# Altium project ControlBoard_2_0.PrjPCB
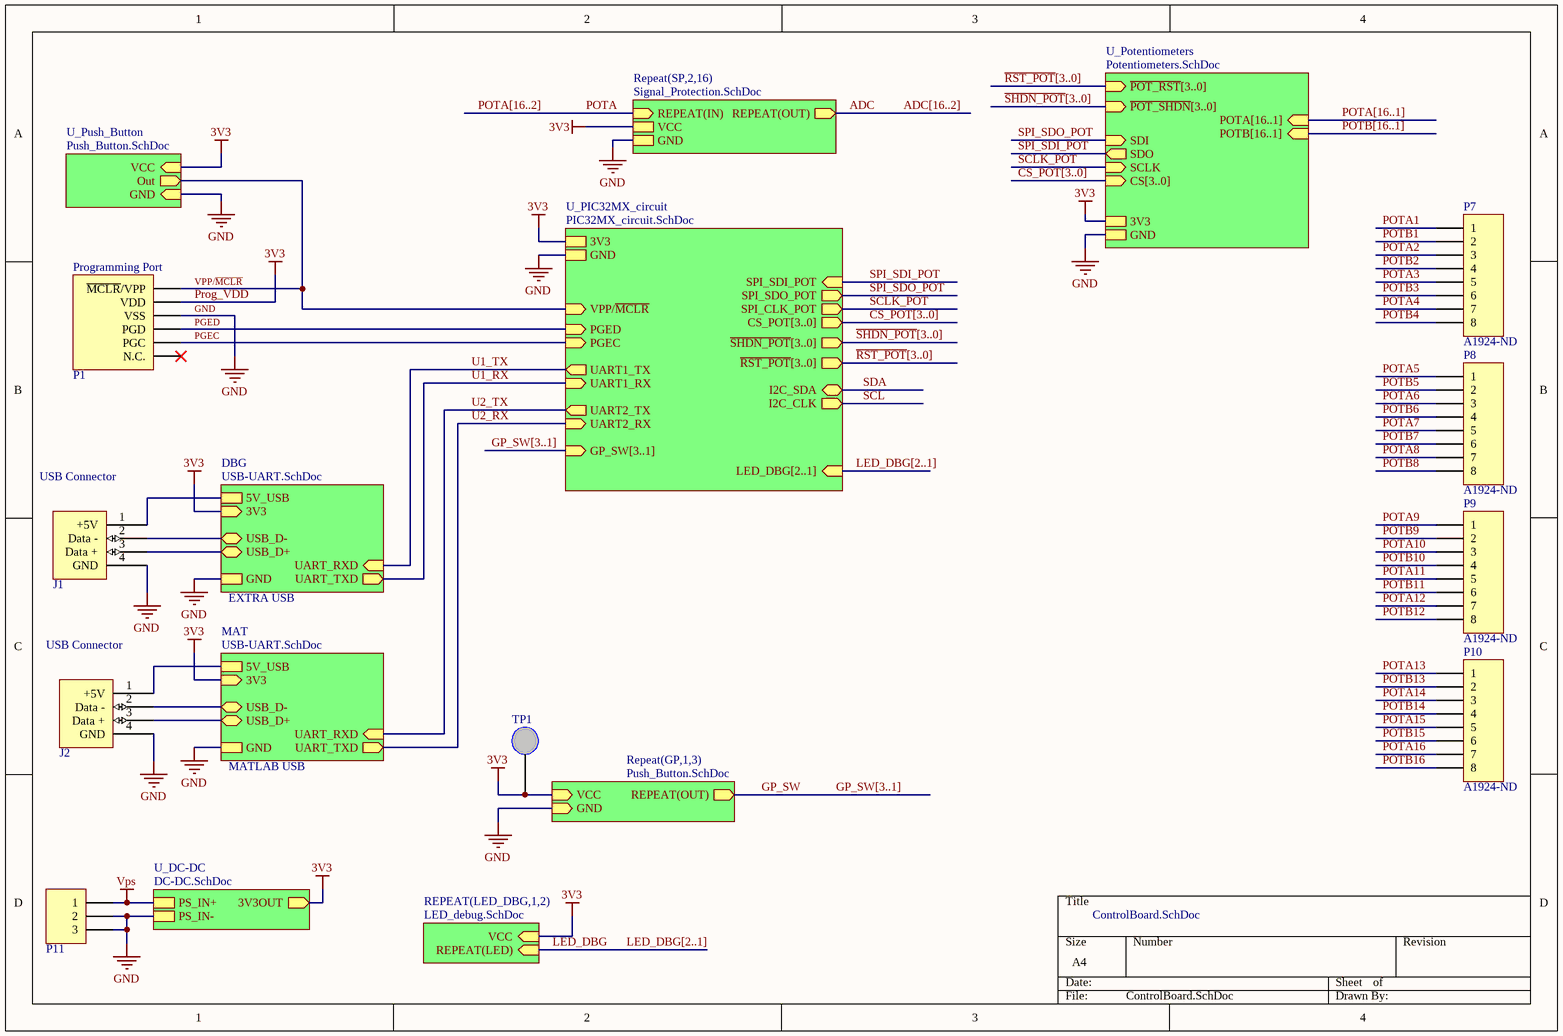
[diagram p0: ControlBoard.SchDoc]
10 sheets, 133 parts. Net scope: hierarchical (ports join the sheet entries above them; power ports are global).
Board file: ControlBoard.PcbDoc
Sheets:
  ControlBoard.SchDoc
    U_PIC32MX_circuit = PIC32MX_circuit.SchDoc
    U_DC-DC = DC-DC.SchDoc
    MAT = USB-UART.SchDoc
    DBG = USB-UART.SchDoc
  Potentiometer.SchDoc
  Signal_Acquisition.SchDoc
    ADC1 = ADS7952-Q1.SchDoc
    ADC2 = ADS7952-Q1.SchDoc
    U_Vref = Vref.SchDoc
    U_Power_Enable = Power_Enable.SchDoc
    U_PGA = PGA.SchDoc
    U_PGA = PGA.SchDoc
    U_PGA = PGA.SchDoc
    U_PGA = PGA.SchDoc

## Sheet ControlBoard.SchDoc
size A4

### Parts
J1  USB 4 pins  [CON-USB TYPE B]  (value not drawn)
J2  USB 4 pins  [CON-USB TYPE B]  (value not drawn)
P1  CON - HEADER PROG  [CON-HEADER-1X6-RA]  (value not drawn)
P7  Supplier Part Number 1: A1924-ND  [CON-HEADER-1X8]  (hidden comment: CON - HEADER 1X8)
P8  Supplier Part Number 1: A1924-ND  [CON-HEADER-1X8]  (hidden comment: CON - HEADER 1X8)
P9  Supplier Part Number 1: A1924-ND  [CON-HEADER-1X8]  (hidden comment: CON - HEADER 1X8)
P10  Supplier Part Number 1: A1924-ND  [CON-HEADER-1X8]  (hidden comment: CON - HEADER 1X8)
P11  CON - POWER CONNECTOR  [CON-POWER CONNECTOR]  (value not drawn)
TP1  5003K  [TP - VERTICAL]  (value not drawn)

### Sub-sheets
DBG = USB-UART.SchDoc: 3V3 (in), GND, UART_RXD (in), UART_TXD (out), 5V_USB, USB_D- (bidir), USB_D+ (bidir)
MAT = USB-UART.SchDoc: 3V3 (in), GND, UART_RXD (in), UART_TXD (out), 5V_USB, USB_D- (bidir), USB_D+ (bidir)
Repeat(GP,1,3) = Push_Button.SchDoc (file not in this document): REPEAT(OUT) (out), GND (in), VCC (in)
REPEAT(LED_DBG,1,2) = LED_debug.SchDoc (file not in this document): VCC (in), REPEAT(LED) (in)
Repeat(SP,2,16) = Signal_Protection.SchDoc (file not in this document): REPEAT(IN) (in), REPEAT(OUT) (out), VCC, GND
U_DC-DC = DC-DC.SchDoc: 3V3OUT (out), PS_IN+, PS_IN-
U_PIC32MX_circuit = PIC32MX_circuit.SchDoc: 3V3, GND, UART2_TX (out), UART2_RX (in), GP_SW[3..1] (in), PGED (in), PGEC (in), VPP/~{MCLR} (in), UART1_TX (out), UART1_RX (in), I2C_SDA (bidir), I2C_CLK (out), ~{RST_POT}[3..0] (out), ~{SHDN_POT}[3..0] (out), LED_DBG[2..1] (in), SPI_CLK_POT (out), SPI_SDI_POT (in), CS_POT[3..0] (out), SPI_SDO_POT (out)
U_Potentiometers = Potentiometers.SchDoc (file not in this document): SDI (in), SCLK (in), 3V3, GND, POTB[16..1] (in), CS[3..0] (in), ~{POT_RST}[3..0] (in), ~{POT_SHDN}[3..0] (in), SDO (out), POTA[16..1] (in)
U_Push_Button = Push_Button.SchDoc (file not in this document): Out (out), VCC (in), GND (in)

### Nets
5V_USB: J1.1(+5V) J2.1(+5V) ; sheet MAT/5V_USB, sheet DBG/5V_USB
GND: J1.4(GND) J1.5(Shield) J1.6(Shield) J2.4(GND) J2.5(Shield) J2.6(Shield) P1.3(VSS) P11.2 P11.3 ; sheet U_Potentiometers/GND, sheet U_PIC32MX_circuit/GND, sheet U_DC-DC/PS_IN-, sheet Repeat(GP,1,3)/GND, sheet MAT/GND, sheet DBG/GND, sheet Repeat(SP,2,16)/GND, sheet U_Push_Button/GND
Prog_VDD: P1.2(VDD) TP1.1 ; sheet U_Potentiometers/3V3, sheet U_PIC32MX_circuit/3V3, sheet U_DC-DC/3V3OUT, sheet Repeat(GP,1,3)/VCC, sheet MAT/3V3, sheet DBG/3V3, sheet Repeat(SP,2,16)/VCC, sheet U_Push_Button/VCC, sheet REPEAT(LED_DBG,1,2)/VCC  [also labelled 3V3]
Vps: P11.1 ; sheet U_DC-DC/PS_IN+
ADC: sheet Repeat(SP,2,16)/REPEAT(OUT)
GP_SW: sheet Repeat(GP,1,3)/REPEAT(OUT)
LED_DBG: sheet REPEAT(LED_DBG,1,2)/REPEAT(LED)
PGEC: P1.5(PGC) ; sheet U_PIC32MX_circuit/PGEC
PGED: P1.4(PGD) ; sheet U_PIC32MX_circuit/PGED
POTA: sheet Repeat(SP,2,16)/REPEAT(IN)
POTA1: P7.1
POTA2: P7.3
POTA3: P7.5
POTA4: P7.7
POTA5: P8.1
POTA6: P8.3
POTA7: P8.5
POTA8: P8.7
POTA9: P9.1
POTA10: P9.3
POTA11: P9.5
POTA12: P9.7
POTA13: P10.1
POTA14: P10.3
POTA15: P10.5
POTA16: P10.7
POTB1: P7.2
POTB2: P7.4
POTB3: P7.6
POTB4: P7.8
POTB5: P8.2
POTB6: P8.4
POTB7: P8.6
POTB8: P8.8
POTB9: P9.2
POTB10: P9.4
POTB11: P9.6
POTB12: P9.8
POTB13: P10.2
POTB14: P10.4
POTB15: P10.6
POTB16: P10.8
SCLK_POT: sheet U_Potentiometers/SCLK, sheet U_PIC32MX_circuit/SPI_CLK_POT
SPI_SDI_POT: sheet U_Potentiometers/SDO, sheet U_PIC32MX_circuit/SPI_SDI_POT
SPI_SDO_POT: sheet U_Potentiometers/SDI, sheet U_PIC32MX_circuit/SPI_SDO_POT
U1_RX: sheet U_PIC32MX_circuit/UART1_RX, sheet DBG/UART_TXD
U1_TX: sheet U_PIC32MX_circuit/UART1_TX, sheet DBG/UART_RXD
U2_RX: sheet U_PIC32MX_circuit/UART2_RX, sheet MAT/UART_TXD
U2_TX: sheet U_PIC32MX_circuit/UART2_TX, sheet MAT/UART_RXD
USB_D+: J2.3(Data_+) ; sheet MAT/USB_D+
USB_D+: J1.3(Data_+) ; sheet DBG/USB_D+  [a separate net that carries the same name]
USB_D-: J2.2(Data_-) ; sheet MAT/USB_D-
USB_D-: J1.2(Data_-) ; sheet DBG/USB_D-  [a separate net that carries the same name]
VPP/~{MCLR}: P1.1(~{MCLR}/VPP) ; sheet U_PIC32MX_circuit/VPP/~{MCLR}, sheet U_Push_Button/Out

Not connected (* = marked no-connect by the designer): P1 6(N.C.)*

### Buses and harness runs
bus ADC[16..2]
bus CS_POT[3..0] = sheet U_PIC32MX_circuit/CS_POT[3..0]
bus CS_POT[3..0] = sheet U_Potentiometers/CS[3..0]
bus GP_SW[3..1]
bus GP_SW[3..1] = sheet U_PIC32MX_circuit/GP_SW[3..1]
bus LED_DBG[2..1]
bus LED_DBG[2..1] = sheet U_PIC32MX_circuit/LED_DBG[2..1]
bus POTA[16..1] = sheet U_Potentiometers/POTA[16..1]
bus POTA[16..2]
bus POTB[16..1] = sheet U_Potentiometers/POTB[16..1]
bus ~{RST_POT}[3..0] = sheet U_PIC32MX_circuit/~{RST_POT}[3..0]
bus ~{RST_POT}[3..0] = sheet U_Potentiometers/~{POT_RST}[3..0]
bus ~{SHDN_POT}[3..0] = sheet U_PIC32MX_circuit/~{SHDN_POT}[3..0]
bus ~{SHDN_POT}[3..0] = sheet U_Potentiometers/~{POT_SHDN}[3..0]

### Notes on the sheet
- (near P1) Programming Port
- (near J1) USB Connector
- (near J2) USB Connector
- EXTRA USB
- MATLAB USB

### Library data of the parts
J1 J2 = CON - USB TYPE B 4 pins: 4 pin USB connector with 2 shield pins; Manufacturer: FCI; Supplier 1: Digi-Key; Supplier Part Number 1: 609-3656-ND; (FLIED A): *; (FLIED B): *; (FLIED C): *
P1 = CON - PROG HEADER 6: MICROCHIP CONNECTOR; (FLIED A): *; (FLIED B): *; (FLIED C): *; Manufacturer: *; Supplier 1: Digi-Key; Supplier Part Number 1: 609-3263-ND
P7-P10 = CON - HEADER 1X8: 100mil header 1 row 6 pins; Manufacturer: *; (FIELD A): *; (FIELD B): *; (FIELD C): *; Supplier 1: Digi-Key
P11 = CON - POWER CONNECTOR: CONN PWR JACK 2.1X5.5MM HIGH CUR; Manufacturer: *; (FIELD A): *; (FIELD B): *; (FIELD C): *; Supplier 1: Digi-Key; Supplier Part Number 1: CP-002AH-ND
TP1 = TP - Test point vertical: (FIELD A): *; (FIELD B): *; (FIELD C): *; Manufacturer: *; Supplier 1: Newark; Supplier Part Number 1: 62W5140

## Sheet PIC32MX_circuit.SchDoc
size A4
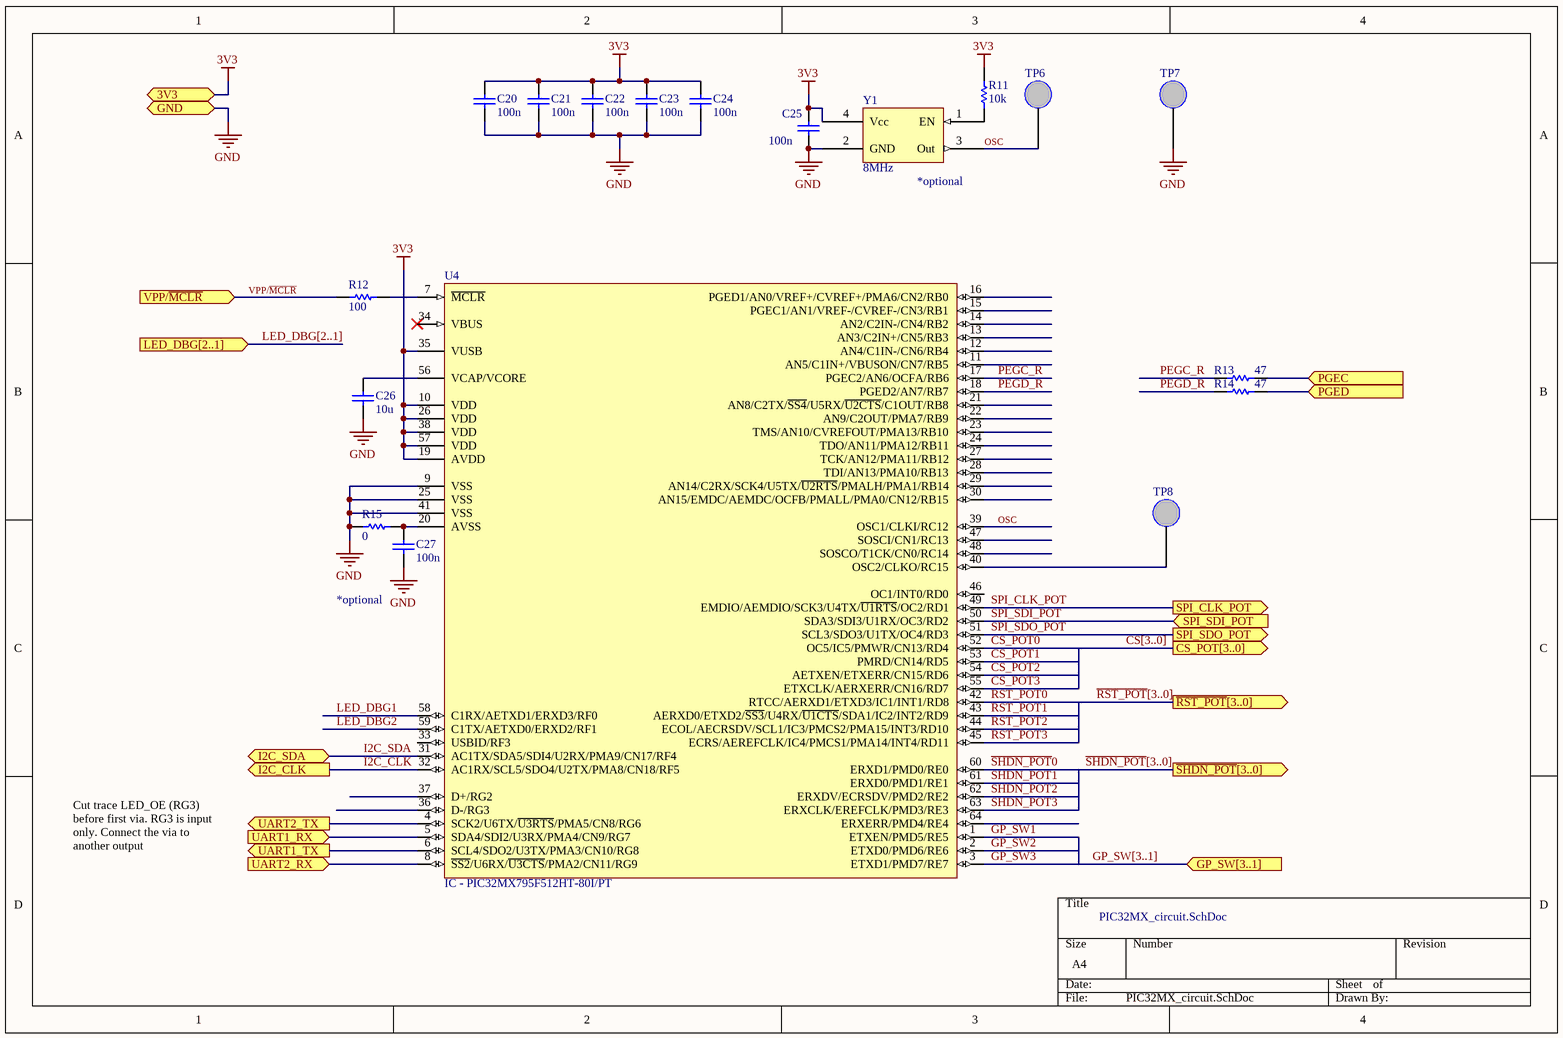
[diagram p1: PIC32MX_circuit.SchDoc]

### Parts
C20  value 100n  [CS-0603]  (hidden comment: CS - CAPACITOR)
C21  value 100n  [CS-0603]  (hidden comment: CS - CAPACITOR)
C22  value 100n  [CS-0603]  (hidden comment: CS - CAPACITOR)
C23  value 100n  [CS-0603]  (hidden comment: CS - CAPACITOR)
C24  value 100n  [CS-0603]  (hidden comment: CS - CAPACITOR)
C25  value 100n  [CS-0603]  (hidden comment: CS - CAPACITOR)
C26  value 10u  [CS-0603]  (hidden comment: CS - CAPACITOR)
C27  value 100n  [CS-0603]  (hidden comment: CS - CAPACITOR)
R11  value 10k  [RS-0603]  (hidden comment: RS - RESISTOR)
R12  value 100  [RS-0603]  (hidden comment: RS - RESISTOR)
R13  value 47  [RS-0603]  (hidden comment: RS - RESISTOR)
R14  value 47  [RS-0603]  (hidden comment: RS - RESISTOR)
R15  value 0  [RS-0603]  (hidden comment: RS - RESISTOR)
TP6  5003K  [TP - VERTICAL]  (value not drawn)
TP7  5003K  [TP - VERTICAL]  (value not drawn)
TP8  5003K  [TP - VERTICAL]  (value not drawn)
U4  IC - PIC32MX795F512HT-80I/PT  [IC-TQFP-64]
Y1  8MHz  [OSC-CB3LV]

### Ports
3V3, CS_POT[3..0] (out), GND, GP_SW[3..1] (in), I2C_CLK (out), I2C_SDA (bidir), LED_DBG[2..1] (in), PGEC (in), PGED (in), SPI_CLK_POT (out), SPI_SDI_POT (in), SPI_SDO_POT (out), UART1_RX (in), UART1_TX (out), UART2_RX (in), UART2_TX (out), VPP/~{MCLR} (in), ~{RST_POT}[3..0] (out), ~{SHDN_POT}[3..0] (out)

### Nets
3V3: C20.2 C21.2 C22.2 C23.2 C24.2 C25.2 R11.1 U4.10(VDD) U4.19(AVDD) U4.26(VDD) U4.35(VUSB) U4.38(VDD) U4.57(VDD) Y1.4(Vcc) ; port 3V3  [project net Prog_VDD]
GND: C20.1 C21.1 C22.1 C23.1 C24.1 C25.1 C26.1 C27.1 R15.2 TP7.1 U4.9(VSS) U4.25(VSS) U4.41(VSS) Y1.2(GND) ; port GND
CS_POT0: U4.52(OC5/IC5/PMWR/CN13/RD4)
CS_POT1: U4.53(PMRD/CN14/RD5)
CS_POT2: U4.54(AETXEN/ETXERR/CN15/RD6)
CS_POT3: U4.55(ETXCLK/AERXERR/CN16/RD7)
GP_SW1: U4.1(ETXEN/PMD5/RE5)
GP_SW2: U4.2(ETXD0/PMD6/RE6)
GP_SW3: U4.3(ETXD1/PMD7/RE7)
I2C_CLK: U4.32(AC1RX/SCL5/SDO4/U2TX/PMA8/CN18/RF5) ; port I2C_CLK
I2C_SDA: U4.31(AC1TX/SDA5/SDI4/U2RX/PMA9/CN17/RF4) ; port I2C_SDA
LED_DBG1: U4.58(C1RX/AETXD1/ERXD3/RF0)
LED_DBG2: U4.59(C1TX/AETXD0/ERXD2/RF1)
OSC: TP6.1 U4.39(OSC1/CLKI/RC12) Y1.3(Out)
PEGC_R: R13.1 U4.17(PGEC2/AN6/OCFA/RB6)
PEGD_R: R14.1 U4.18(PGED2/AN7/RB7)
PGEC: R13.2 ; port PGEC
PGED: R14.2 ; port PGED
~{RST_POT}0: U4.42(RTCC/AERXD1/ETXD3/IC1/INT1/RD8)
~{RST_POT}1: U4.43(AERXD0/ETXD2/~{SS3}/U4RX/~{U1CTS}/SDA1/IC2/INT2/RD9)
~{RST_POT}2: U4.44(ECOL/AECRSDV/SCL1/IC3/PMCS2/PMA15/INT3/RD10)
~{RST_POT}3: U4.45(ECRS/AEREFCLK/IC4/PMCS1/PMA14/INT4/RD11)
~{SHDN_POT}0: U4.60(ERXD1/PMD0/RE0)
~{SHDN_POT}1: U4.61(ERXD0/PMD1/RE1)
~{SHDN_POT}2: U4.62(ERXDV/ECRSDV/PMD2/RE2)
~{SHDN_POT}3: U4.63(ERXCLK/EREFCLK/PMD3/RE3)
SPI_CLK_POT: U4.49(EMDIO/AEMDIO/SCK3/U4TX/~{U1RTS}/OC2/RD1) ; port SPI_CLK_POT  [project net SCLK_POT]
SPI_SDI_POT: U4.50(SDA3/SDI3/U1RX/OC3/RD2) ; port SPI_SDI_POT
SPI_SDO_POT: U4.51(SCL3/SDO3/U1TX/OC4/RD3) ; port SPI_SDO_POT
U1_RX: U4.5(SDA4/SDI2/U3RX/PMA4/CN9/RG7) ; port UART1_RX
U1_TX: U4.6(SCL4/SDO2/U3TX/PMA3/CN10/RG8) ; port UART1_TX
U2_RX: U4.8(~{SS2}/U6RX/~{U3CTS}/PMA2/CN11/RG9) ; port UART2_RX
U2_TX: U4.4(SCK2/U6TX/~{U3RTS}/PMA5/CN8/RG6) ; port UART2_TX
VPP/~{MCLR}: R12.2 ; port VPP/~{MCLR}
NetC26_2: C26.2 U4.56(VCAP/VCORE)
NetC27_2: C27.2 R15.1 U4.20(AVSS)
NetR11_2: R11.2 Y1.1(EN)
NetR12_1: R12.1 U4.7(~{MCLR})
NetTP8_1: TP8.1 U4.40(OSC2/CLKO/RC15)

Not connected (* = marked no-connect by the designer): U4 11(AN5/C1IN+/VBUSON/CN7/RB5) 12(AN4/C1IN-/CN6/RB4) 13(AN3/C2IN+/CN5/RB3) 14(AN2/C2IN-/CN4/RB2) 15(PGEC1/AN1/VREF-/CVREF-/CN3/RB1) 16(PGED1/AN0/VREF+/CVREF+/PMA6/CN2/RB0) 21(AN8/C2TX/~{SS4}/U5RX/~{U2CTS}/C1OUT/RB8) 22(AN9/C2OUT/PMA7/RB9) 23(TMS/AN10/CVREFOUT/PMA13/RB10) 24(TDO/AN11/PMA12/RB11) 27(TCK/AN12/PMA11/RB12) 28(TDI/AN13/PMA10/RB13) 29(AN14/C2RX/SCK4/U5TX/~{U2RTS}/PMALH/PMA1/RB14) 30(AN15/EMDC/AEMDC/OCFB/PMALL/PMA0/CN12/RB15) 33(USBID/RF3) 34(VBUS)* 36(D-/RG3) 37(D+/RG2) 46(OC1/INT0/RD0) 47(SOSCI/CN1/RC13) 48(SOSCO/T1CK/CN0/RC14) 64(ERXERR/PMD4/RE4)

### Buses and harness runs
bus CS[3..0] = port CS_POT[3..0]
bus GP_SW[3..1] = port GP_SW[3..1]
bus LED_DBG[2..1] = port LED_DBG[2..1]
bus ~{RST_POT}[3..0] = port ~{RST_POT}[3..0]
bus ~{SHDN_POT}[3..0] = port ~{SHDN_POT}[3..0]

### Notes on the sheet
- (near Y1) *optional
- *optional
- Cut trace LED_OE (RG3) before first via. RG3 is input only. Connect the via to another output

### Library data of the parts
C20-C27 = CS - CAPACITOR: TOLERANCE: 10%; VOLTAGE: 16V; Supplier 1: *; Supplier Part Number 1: *; (FIELD A): *; (FLIED C): *; (FIELD B): *; Manufacturer: *
R11-R15 = RS - RESISTOR: TOLERANCE: RES TOL; POWER: RES POWER; Supplier Part Number 1: *; Supplier 1: *; (FIELD A): *; (FLIED C): *; (FIELD B): *; Manufacturer: *
TP6-TP8 = TP - Test point vertical: (FIELD A): *; (FIELD B): *; (FIELD C): *; Manufacturer: *; Supplier 1: Newark; Supplier Part Number 1: 62W5140
U4 = IC - PIC32MX795F512HT-80I/PT: Manufacturer: Microchip; Supplier 1: Digi-Key; Supplier Part Number 1: PIC32MX795F512H-80I/PT-ND; (FLIED A): *; (FLIED B): *; (FLIED C): *
Y1 = OSC - CB3LV: Oscillator; Supplier 1: Digi-Key; Supplier Part Number 1: CTX264LVCT-ND; (FLIED A): *; (FLIED B): *; (FLIED C): *; Manufacturer: *; Frequency: *

## Sheet DC-DC.SchDoc
size A4
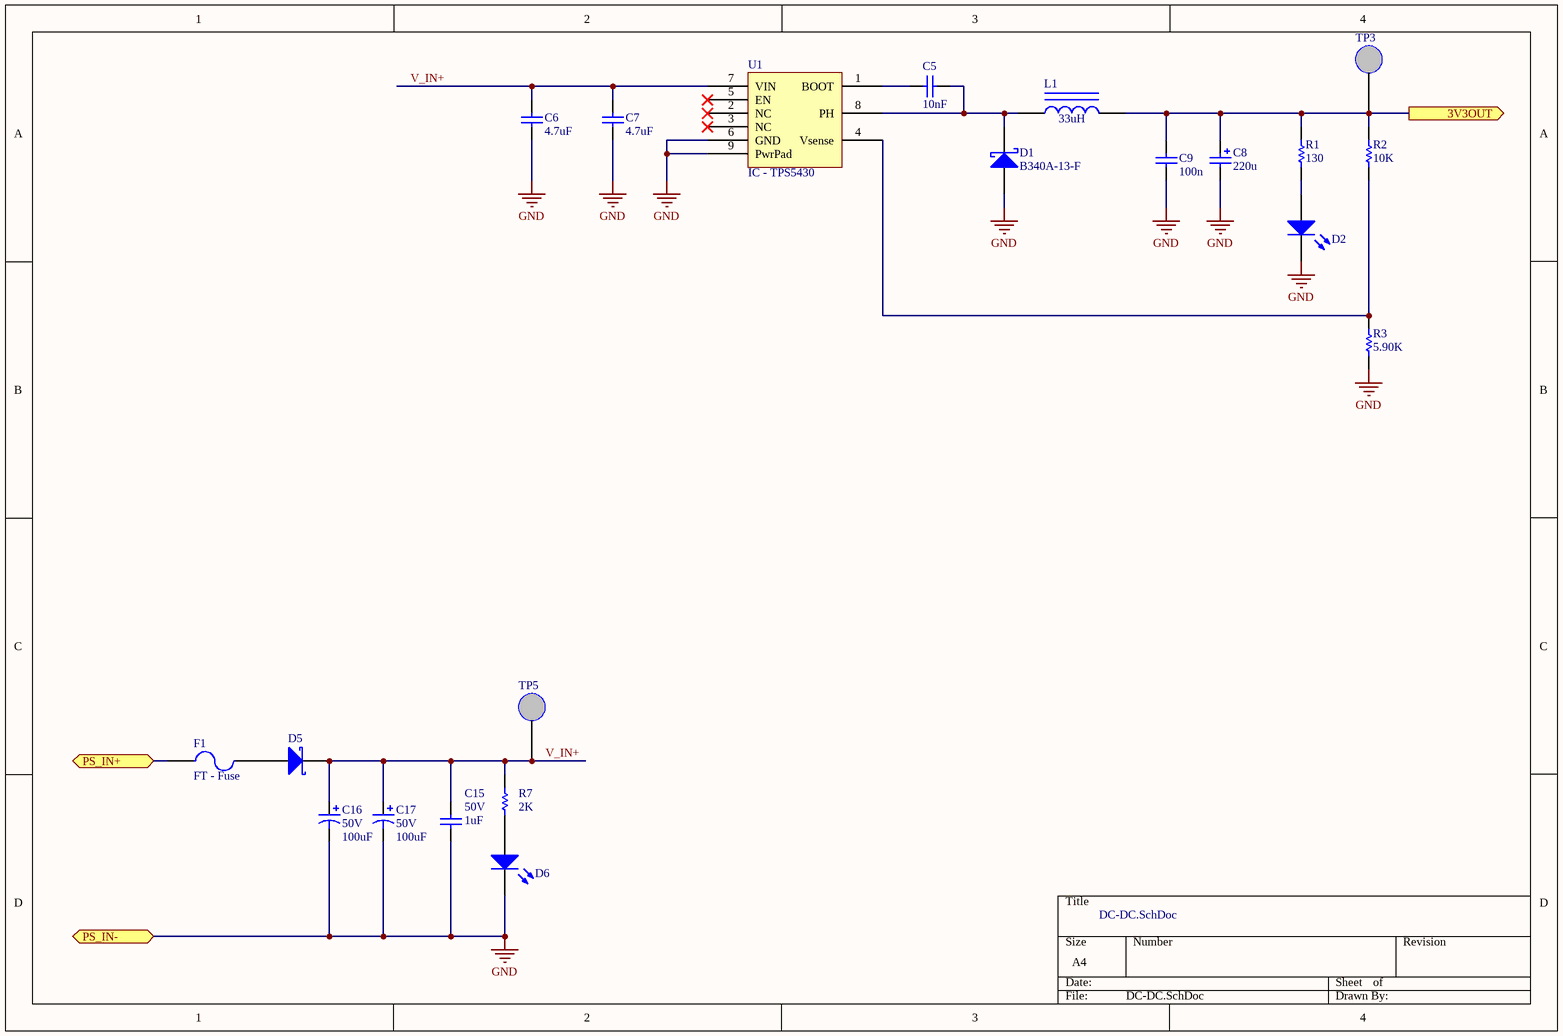
[diagram p2: DC-DC.SchDoc]

### Parts
C5  value 10nF  [CS-0603]  (hidden comment: CS - CAPACITOR)
C6  value 4.7uF  [CS-1206]  (hidden comment: CS - CAPACITOR)
C7  value 4.7uF  [CS-1206]  (hidden comment: CS - CAPACITOR)
C8  value 220u  [CS-2312]  (hidden comment: CS - CAPACITOR POL)
C9  value 100n  [CS-0603]  (hidden comment: CS - CAPACITOR)
C15  value 1uF  VOLTAGE: 50V  [CS-0603]  (hidden comment: CS - CAPACITOR)
C16  value 100uF  VOLTAGE: 50V  [CT-CAP-ALUM-8X14]  (hidden comment: CT - CAPACITOR ELECTROLYTIC)
C17  value 100uF  VOLTAGE: 50V  [CT-CAP-ALUM-8X14]  (hidden comment: CT - CAPACITOR ELECTROLYTIC)
D1  B340A-13-F  [DS-DO-214AC-SMA]
D2  LED - NORMAL LED  [LED-0603 YELLOW]  (value not drawn)
D5  DT - Diode  [TO-220AC]  (value not drawn)
D6  LED - NORMAL LED  [LED-0603 YELLOW]  (value not drawn)
F1  FT - Fuse  [FT - 5mm x 20mm]
L1  value 33uH  [LS-Inductor SMD]  (hidden comment: LS - INDUCTOR)
R1  value 130  [RS-0603]  (hidden comment: RS - RESISTOR)
R2  value 10K  [RS-0603]  (hidden comment: RS - RESISTOR)
R3  value 5.90K  [RS-0603]  (hidden comment: RS - RESISTOR)
R7  value 2K  [RS-0603]  (hidden comment: RS - RESISTOR)
TP3  5003K  [TP - VERTICAL]  (value not drawn)
TP5  5003K  [TP - VERTICAL]  (value not drawn)
U1  IC - TPS5430  [IC-SOIC8-POWERPAD]

### Ports
3V3OUT (out), PS_IN+, PS_IN-

### Nets
GND: C6.1 C7.1 C8.2 C9.1 C15.1 C16.2 C17.2 D1.A D2.K D6.K R3.2 U1.6(GND) U1.9(PwrPad) ; port PS_IN-
Prog_VDD: C8.1 C9.2 L1.2 R1.1 R2.1 TP3.1 ; port 3V3OUT
Vps: F1.1 ; port PS_IN+
V_IN+: C6.2 C7.2 C15.2 C16.1 C17.1 D5.1(K) R7.2 TP5.1 U1.7(VIN)
NetC5_1: C5.1 D1.K L1.1 U1.8(PH)
NetC5_2: C5.2 U1.1(BOOT)
NetD2_A: D2.A R1.2
NetD5_3: D5.3(A) F1.2
NetD6_A: D6.A R7.1
NetR2_2: R2.2 R3.1 U1.4(Vsense)

Not connected (* = marked no-connect by the designer): U1 2(NC)* 3(NC)* 5(EN)*

### Library data of the parts
C5 = CS - CAPACITOR: CAP CER 10000PF 50V 10% X7R 0603; Manufacturer: TDK; (FIELD A): tantalum; VOLTAGE: 16V; Supplier 1: Digikey; Supplier Part Number 1: 445-1311-1-ND; (FLIED C): *; (FIELD B): *; TOLERANCE: 10%
C6 C7 = CS - CAPACITOR: Manufacturer: Samsung; TOLERANCE: 10%; VOLTAGE: 16V; Supplier 1: Digikey; Supplier Part Number 1: 1276-1292-1-ND; (FIELD A): *; (FLIED C): *; (FIELD B): *
C8 = CS - CAPACITOR POL: TOLERANCE: 10%; Supplier 1: *; Supplier Part Number 1: *; (FIELD A): *; (FLIED C): *; (FIELD B): *; Manufacturer: *; VOLTAGE: VOLTAGE; Supplier 2: Digi-Key; Supplier Part Number 2: 478-5236-1-ND
C9 = CS - CAPACITOR: TOLERANCE: 10%; VOLTAGE: 16V; Supplier 1: *; Supplier Part Number 1: 490-1532-1-ND; (FIELD A): *; (FLIED C): *; (FIELD B): *; Manufacturer: *
C15 = CS - CAPACITOR: TOLERANCE: 10%; Supplier 1: *; Supplier Part Number 1: *; (FIELD A): *; (FLIED C): *; (FIELD B): *; Manufacturer: *
C16 C17 = CT - CAPACITOR ELECTROLYTIC: TOLERANCE: 10%; Supplier 1: *; Supplier Part Number 1: *; (FIELD A): *; (FLIED C): *; (FIELD B): *; Manufacturer: *
D1 = DS - Schottky: DIODE SCHOTTKY 40V 3A SMA; Manufacturer: Diodes Incorporated; Supplier Part Number 1: B340A-FDICT-ND; Supplier 1: Digikey; FORWARS VOLTAGE: *; (FIELD A): *; (FIELD B): *; (FIELD C): *; Supplier 2: Digi-Key; Supplier Part Number 2: B340A-FDICT-ND
D5 = Diode 18TQ045: Zener Schottky; Supplier 1: *; Supplier 2: Digi-Key; FORWARD VOLTAGE: *; Supplier Part Number 2: MBR1645-E3/45GI-ND; Supplier Part Number 1: *; (FIELD A): *; (FIELD B): *; (FIELD C): *; CURRENT MAX: *
F1 = FT - Fuse: Manufacturer: Schurter Inc; Supplier 1: Digikey; Supplier Part Number 1: 486-1259-ND
L1 = LS - INDUCTOR: INDUCTOR SHIELD PWR; Manufacturer: Bourns Inc; CURRENT: 2.8A; IMAX: 3A; (FIELD A): *; (FIELD B): *; (FIELD C): *; RESISTOR: *; Supplier 1: Digikey; Supplier Part Number 1: SRR1260-330M
R1-R3 = RS - RESISTOR: TOLERANCE: RES TOL; POWER: RES POWER; Supplier Part Number 1: *; Supplier 1: *; (FIELD A): *; (FLIED C): *; (FIELD B): *; Manufacturer: *
R7 = RS - RESISTOR: TOLERANCE: RES TOL; POWER: 1/10W; Supplier Part Number 1: *; Supplier 1: *; (FIELD A): *; (FLIED C): *; (FIELD B): *; Manufacturer: *
TP3 TP5 = TP - Test point vertical: (FIELD A): *; (FIELD B): *; (FIELD C): *; Manufacturer: *; Supplier 1: Newark; Supplier Part Number 1: 62W5140
U1 = IC - TPS5430: IC REG BUCK ADJ 3A 8SOPWRPAD; Manufacturer: Texas Instruments; Part Number: TPS5430; Supplier 1: Digi-Key; Supplier Part Number 1: 296-26988-1-ND
D2 D6 = LED - NORMAL LED: FORWARS VOLTAGE: *; CURRENT: *; COLOR: *; Supplier Part Number 1: *; Supplier 1: *; (FIELD B): *; (FIELD A): *; (FIELD C): *; Manufacturer: *

## Sheet USB-UART.SchDoc
size A
Used 2 times, as channels MAT, DBG. Parts and nets are listed once, with the designators drawn on the sheet.
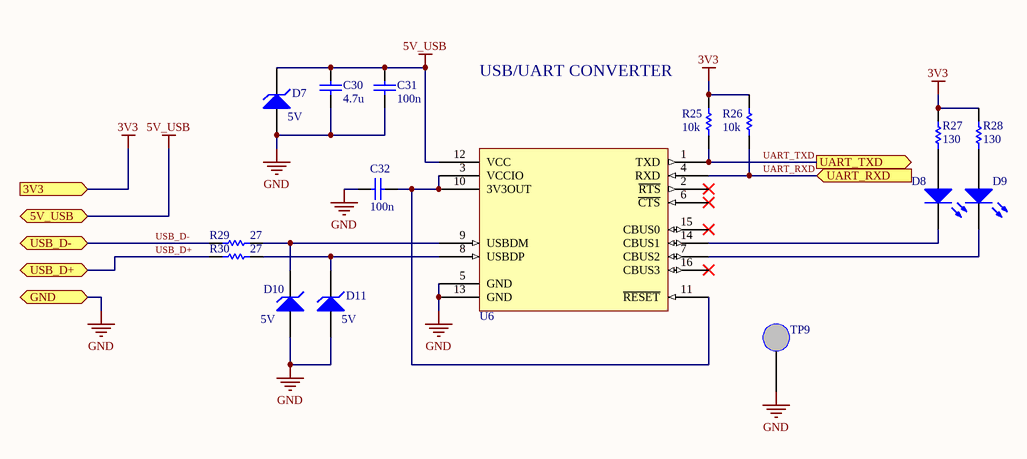
[diagram p3: USB-UART.SchDoc]

### Parts
C30  value 4.7u  [CS-0603]  (hidden comment: CS - CAPACITOR)
C31  value 100n  [CS-0603]  (hidden comment: CS - CAPACITOR)
C32  value 100n  [CS-0603]  (hidden comment: CS - CAPACITOR)
D7  Voltage - Reverse Standoff (Typ): 5V  [DS-SOD523]  (hidden comment: DS - TVS ESD5Z5.0T1G)
D8  LED - NORMAL LED  [LED-0603 GREEN]  (value not drawn)
D9  LED - NORMAL LED  [LED-0603 GREEN]  (value not drawn)
D10  Voltage - Reverse Standoff (Typ): 5V  [DS-SOD523]  (hidden comment: DS - TVS ESD5Z5.0T1G)
D11  Voltage - Reverse Standoff (Typ): 5V  [DS-SOD523]  (hidden comment: DS - TVS ESD5Z5.0T1G)
R25  value 10k  [RS-0603]  (hidden comment: RS - RESISTOR)
R26  value 10k  [RS-0603]  (hidden comment: RS - RESISTOR)
R27  value 130  [RS-0603]  (hidden comment: RS - RESISTOR)
R28  value 130  [RS-0603]  (hidden comment: RS - RESISTOR)
R29  value 27  [RS-0603]  (hidden comment: RS - RESISTOR)
R30  value 27  [RS-0603]  (hidden comment: RS - RESISTOR)
TP9  5003K  [TP - VERTICAL]  (value not drawn)
U6  IC - FT230XS  [IC-SSOP-16]  (value not drawn)

### Ports
3V3 (in), 5V_USB, GND, UART_RXD (in), UART_TXD (out), USB_D+ (bidir), USB_D- (bidir)

### Nets
3V3: R25.2 R26.2 R27.2 R28.2 ; port 3V3
5V_USB: C30.2 C31.2 D7.K U6.12(VCC) ; port 5V_USB
GND: C30.1 C31.1 C32.2 D7.A D10.A D11.A TP9.1 U6.5(GND) U6.13(GND) ; port GND
UART_RXD: R26.1 U6.4(RXD) ; port UART_RXD
UART_TXD: R25.1 U6.1(TXD) ; port UART_TXD
USB_D+: R30.2 ; port USB_D+
USB_D-: R29.2 ; port USB_D-
NetC32_1: C32.1 U6.3(VCCIO) U6.10(3V3OUT) U6.11(~{RESET})
NetD8_A: D8.A R27.1
NetD8_K: D8.K U6.14(CBUS1)
NetD9_A: D9.A R28.1
NetD9_K: D9.K U6.7(CBUS2)
NetD10_K: D10.K R29.1 U6.9(USBDM)
NetD11_K: D11.K R30.1 U6.8(USBDP)

Not connected (* = marked no-connect by the designer): U6 2(~{RTS})* 6(~{CTS})* 15(CBUS0)* 16(CBUS3)*

### Channels
MAT: designators end in .1; ports 3V3=Prog_VDD 5V_USB=5V_USB GND=GND UART_RXD=U2_TX UART_TXD=U2_RX USB_D+=USB_D+ USB_D-=USB_D-
DBG: designators end in .2; ports 3V3=Prog_VDD 5V_USB=5V_USB GND=GND UART_RXD=U1_TX UART_TXD=U1_RX USB_D+=USB_D+ USB_D-=USB_D-

### Notes on the sheet
- USB/UART CONVERTER

### Library data of the parts
C30-C32 = CS - CAPACITOR: TOLERANCE: 10%; VOLTAGE: 16V; Supplier 1: *; (FIELD A): *; (FLIED C): *; (FIELD B): *; Manufacturer: *
  C30: Supplier Part Number 1: *
  C31 C32: Supplier Part Number 1: 490-1532-1-ND
D7 D10 D11 = DS - TVS ESD5Z5.0T1G: TVS 5V; Manufacturer: ON Semiconductor; Supplier Part Number 1: *; Supplier 1: *; FORWARS VOLTAGE: *; (FIELD A): *; (FIELD B): *; Supplier 2: Digi-Key; Supplier Part Number 2: ESD5Z5.0T1GOSCT-ND
R25-R30 = RS - RESISTOR: TOLERANCE: RES TOL; POWER: RES POWER; Supplier Part Number 1: *; Supplier 1: *; (FIELD A): *; (FLIED C): *; (FIELD B): *; Manufacturer: *
TP9 = TP - Test point vertical: (FIELD A): *; (FIELD B): *; (FIELD C): *; Manufacturer: *; Supplier 1: Newark; Supplier Part Number 1: 62W5140
U6 = IC - FT230XS: USB to BASIC UART IC; Manufacturer: FTDI; Supplier 1: Digi-Key; Supplier Part Number 1: 768-1154-5-ND; (FIELD A): *; (FIELD B): *; (FIELD C): *
D8 D9 = LED - NORMAL LED: FORWARS VOLTAGE: *; CURRENT: *; COLOR: *; Supplier Part Number 1: *; Supplier 1: *; (FIELD B): *; (FIELD A): *; (FIELD C): *; Manufacturer: *

## Sheet Potentiometer.SchDoc
size A4
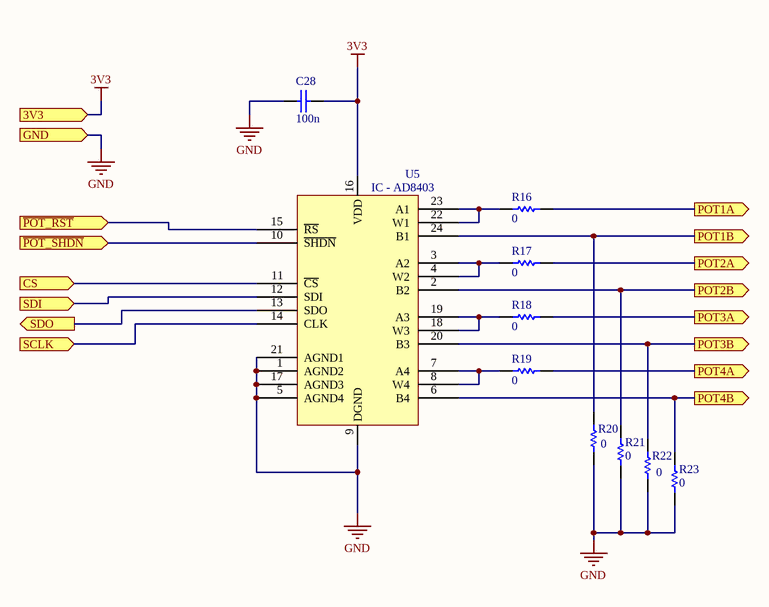
[diagram p4: Potentiometer.SchDoc]

### Parts
C28  value 100n  [CS-0603]  (hidden comment: CS - CAPACITOR)
R16  value 0  [RS-0603]  (hidden comment: RS - RESISTOR)
R17  value 0  [RS-0603]  (hidden comment: RS - RESISTOR)
R18  value 0  [RS-0603]  (hidden comment: RS - RESISTOR)
R19  value 0  [RS-0603]  (hidden comment: RS - RESISTOR)
R20  value 0  [RS-0603]  (hidden comment: RS - RESISTOR)
R21  value 0  [RS-0603]  (hidden comment: RS - RESISTOR)
R22  value 0  [RS-0603]  (hidden comment: RS - RESISTOR)
R23  value 0  [RS-0603]  (hidden comment: RS - RESISTOR)
U5  IC - AD8403  [IC-SOIC-24]

### Ports
3V3, CS (in), GND, POT1A (out), POT1B (out), POT2A (out), POT2B (out), POT3A (out), POT3B (out), POT4A (out), POT4B (out), SCLK (in), SDI (in), SDO (out), ~{POT_RST} (in), ~{POT_SHDN} (in)

### Nets
3V3: C28.1 U5.16(VDD) ; port 3V3  [project net Prog_VDD]
GND: C28.2 R20.2 R21.2 R22.2 R23.2 U5.1(AGND2) U5.5(AGND4) U5.9(DGND) U5.17(AGND3) U5.21(AGND1) ; port GND
NetR16_1: R16.1 ; port POT1A
NetR16_2: R16.2 U5.22(W1) U5.23(A1)
NetR17_1: R17.1 ; port POT2A
NetR17_2: R17.2 U5.3(A2) U5.4(W2)
NetR18_1: R18.1 ; port POT3A
NetR18_2: R18.2 U5.18(W3) U5.19(A3)
NetR19_1: R19.1 ; port POT4A
NetR19_2: R19.2 U5.7(A4) U5.8(W4)
NetR20_1: R20.1 U5.24(B1) ; port POT1B
NetR21_1: R21.1 U5.2(B2) ; port POT2B
NetR22_1: R22.1 U5.20(B3) ; port POT3B
NetR23_1: R23.1 U5.6(B4) ; port POT4B
NetU5_10: U5.10(~{SHDN}) ; port ~{POT_SHDN}
NetU5_11: U5.11(~{CS}) ; port CS
NetU5_12: U5.12(SDI) ; port SDI
NetU5_13: U5.13(SDO) ; port SDO
NetU5_14: U5.14(CLK) ; port SCLK
NetU5_15: U5.15(~{RS}) ; port ~{POT_RST}

### Library data of the parts
C28 = CS - CAPACITOR: TOLERANCE: 10%; VOLTAGE: 16V; Supplier 1: *; Supplier Part Number 1: *; (FIELD A): *; (FLIED C): *; (FIELD B): *; Manufacturer: *
R16-R23 = RS - RESISTOR: TOLERANCE: RES TOL; POWER: RES POWER; Supplier Part Number 1: *; Supplier 1: *; (FIELD A): *; (FLIED C): *; (FIELD B): *; Manufacturer: *
U5 = IC - AD8403: DIGITAL POTENTIOMETER; (FIELD A): *; (FIELD B): *; (FIELD C): *; Manufacturer: *; Supplier 1: Digi-Key; Supplier Part Number 1: AD8403ARZ10-ND

## Sheet Signal_Acquisition.SchDoc
size A4
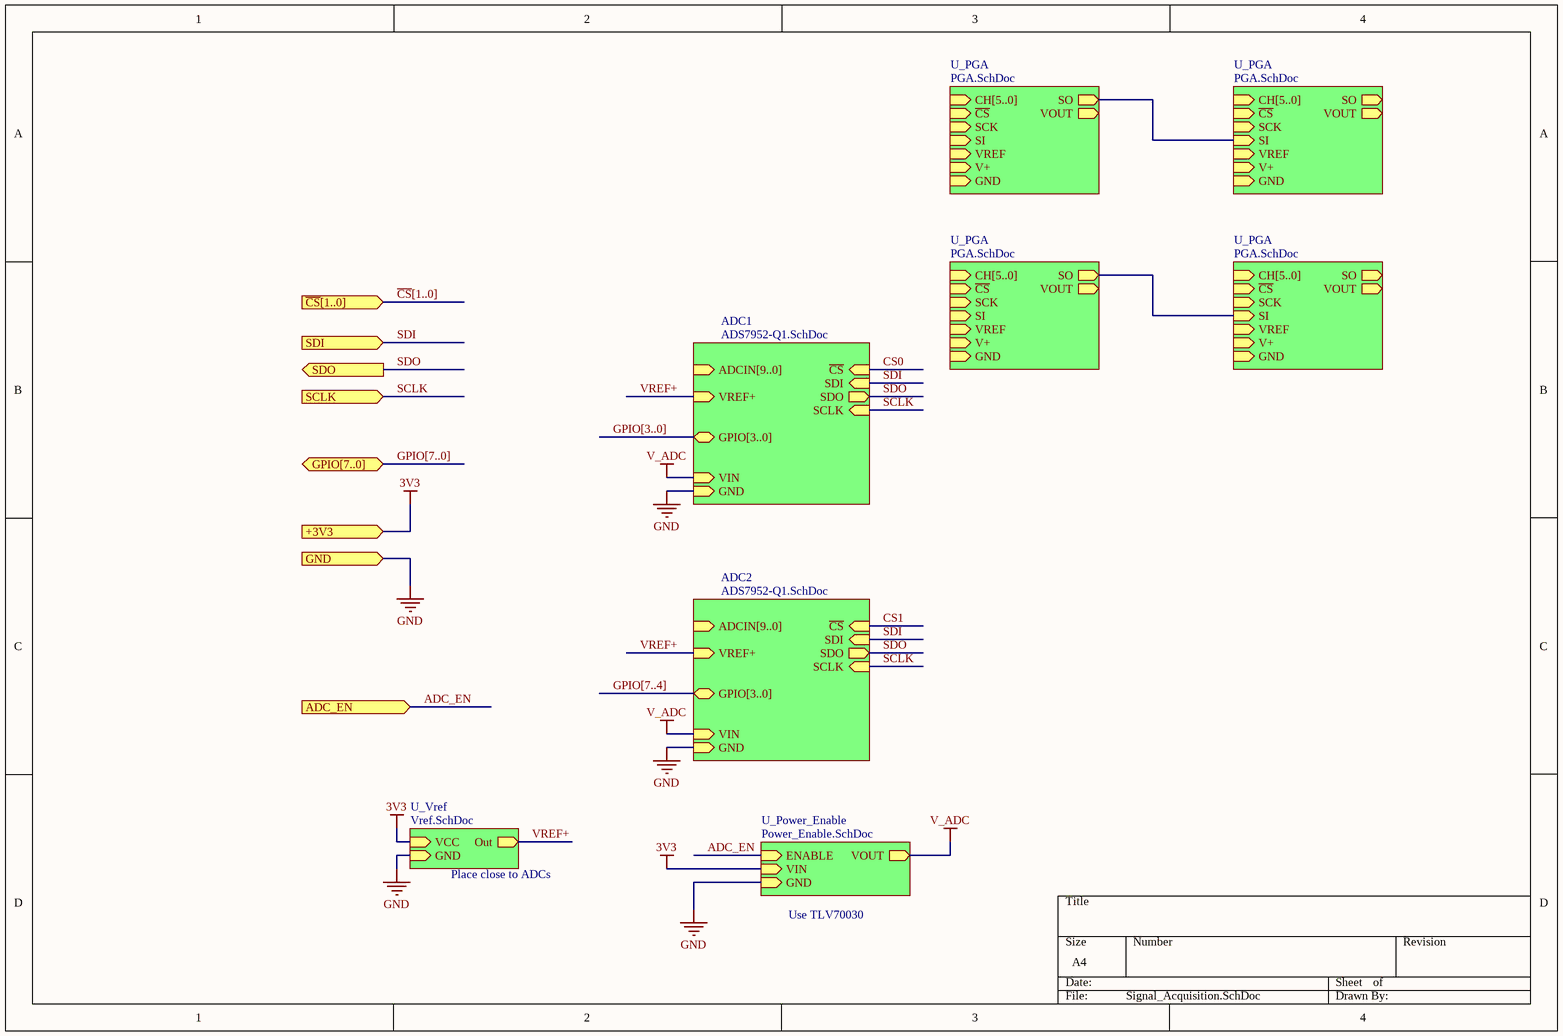
[diagram p5: Signal_Acquisition.SchDoc]

### Sub-sheets
ADC1 = ADS7952-Q1.SchDoc: SDO (out), SDI (in), GPIO[3..0] (bidir), GND (in), VREF+ (in), SCLK (in), ~{CS} (in), ADCIN[9..0] (in), VIN (in)
ADC2 = ADS7952-Q1.SchDoc: SDO (out), SDI (in), GPIO[3..0] (bidir), GND (in), VREF+ (in), SCLK (in), ~{CS} (in), ADCIN[9..0] (in), VIN (in)
U_PGA = PGA.SchDoc: CH[5..0] (in), SO (out), ~{CS} (in), SCK (in), SI (in), VOUT (out), VREF (in), V+ (in), GND (in)
U_PGA = PGA.SchDoc: CH[5..0] (in), SO (out), ~{CS} (in), SCK (in), SI (in), VOUT (out), VREF (in), V+ (in), GND (in)
U_PGA = PGA.SchDoc: CH[5..0] (in), SO (out), ~{CS} (in), SCK (in), SI (in), VOUT (out), VREF (in), V+ (in), GND (in)
U_PGA = PGA.SchDoc: CH[5..0] (in), SO (out), ~{CS} (in), SCK (in), SI (in), VOUT (out), VREF (in), V+ (in), GND (in)
U_Power_Enable = Power_Enable.SchDoc: ENABLE (in), VIN (in), VOUT (out), GND (in)
U_Vref = Vref.SchDoc: Out (out), VCC (in), GND (in)

### Ports
+3V3 (in), ADC_EN (in), GND (in), GPIO[7..0], SCLK (in), SDI (in), SDO (out), ~{CS}[1..0] (in)

### Nets
3V3: port +3V3, sheet U_Vref/VCC, sheet U_Power_Enable/VIN  [project net Prog_VDD]
GND: port GND, sheet ADC1/GND, sheet ADC2/GND, sheet U_Vref/GND, sheet U_Power_Enable/GND
V_ADC: sheet ADC1/VIN, sheet ADC2/VIN, sheet U_Power_Enable/VOUT
ADC_EN: port ADC_EN, sheet U_Power_Enable/ENABLE
SCLK: port SCLK, sheet ADC1/SCLK, sheet ADC2/SCLK
SDI: port SDI, sheet ADC1/SDI, sheet ADC2/SDI
SDO: port SDO, sheet ADC1/SDO, sheet ADC2/SDO
VREF+: sheet ADC1/VREF+, sheet ADC2/VREF+, sheet U_Vref/Out
NetU?.1_12: sheet U_PGA/SO, sheet U_PGA/SI
NetU?.3_12: sheet U_PGA/SO, sheet U_PGA/SI

### Buses and harness runs
bus GPIO[3..0] = sheet ADC1/GPIO[3..0]
bus GPIO[7..0] = port GPIO[7..0]
bus GPIO[7..4] = sheet ADC2/GPIO[3..0]
bus ~{CS}[1..0] = port ~{CS}[1..0]

### Notes on the sheet
- Place close to ADCs
- Use TLV70030

## Sheet ADS7952-Q1.SchDoc
size A4
Used 2 times, as channels ADC1, ADC2. Parts and nets are listed once, with the designators drawn on the sheet.
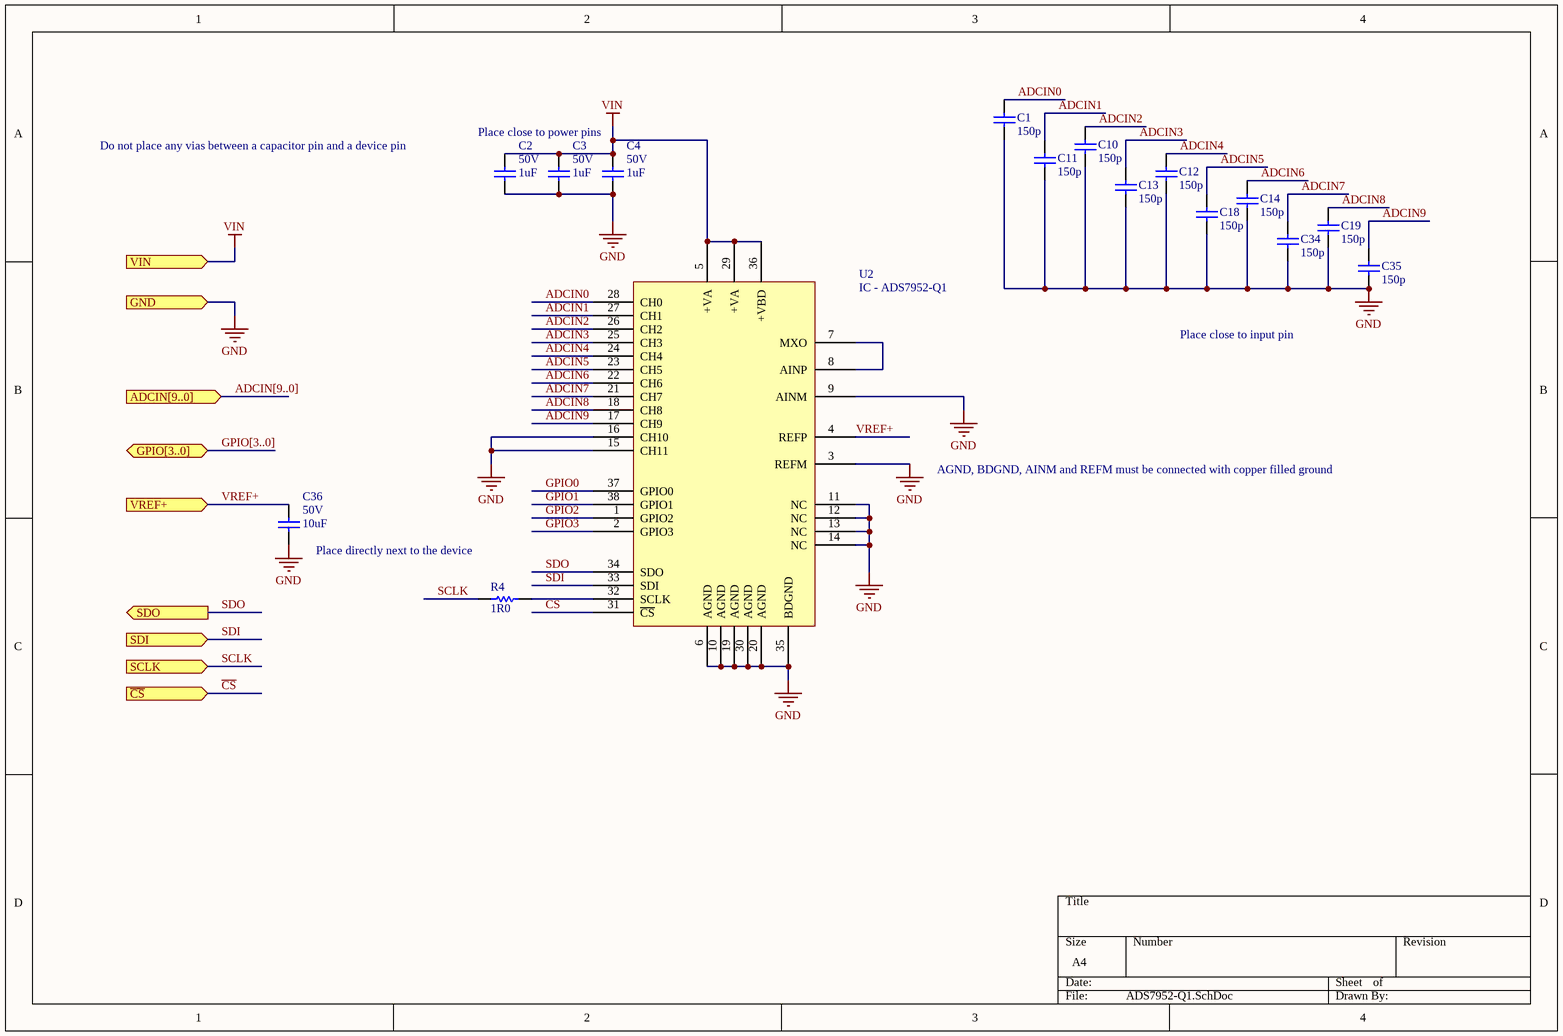
[diagram p6: ADS7952-Q1.SchDoc]

### Parts
C1  value 150p  [CS-0603]  (hidden comment: CS - CAPACITOR)
C2  value 1uF  VOLTAGE: 50V  [CS-0603]  (hidden comment: CS - CAPACITOR)
C3  value 1uF  VOLTAGE: 50V  [CS-0603]  (hidden comment: CS - CAPACITOR)
C4  value 1uF  VOLTAGE: 50V  [CS-0603]  (hidden comment: CS - CAPACITOR)
C10  value 150p  [CS-0603]  (hidden comment: CS - CAPACITOR)
C11  value 150p  [CS-0603]  (hidden comment: CS - CAPACITOR)
C12  value 150p  [CS-0603]  (hidden comment: CS - CAPACITOR)
C13  value 150p  [CS-0603]  (hidden comment: CS - CAPACITOR)
C14  value 150p  [CS-0603]  (hidden comment: CS - CAPACITOR)
C18  value 150p  [CS-0603]  (hidden comment: CS - CAPACITOR)
C19  value 150p  [CS-0603]  (hidden comment: CS - CAPACITOR)
C34  value 150p  [CS-0603]  (hidden comment: CS - CAPACITOR)
C35  value 150p  [CS-0603]  (hidden comment: CS - CAPACITOR)
C36  value 10uF  VOLTAGE: 50V  [CS-0603]  (hidden comment: CS - CAPACITOR)
R4  value 1R0  [RS-0603]  (hidden comment: RS - RESISTOR)
U2  IC - ADS7952-Q1  [IC-TSSOP-38]

### Ports
ADCIN[9..0] (in), GND (in), GPIO[3..0] (bidir), SCLK (in), SDI (in), SDO (out), VIN (in), VREF+ (in), ~{CS} (in)

### Nets
GND: C1.1 C2.1 C3.1 C4.1 C10.1 C11.1 C12.1 C13.1 C14.1 C18.1 C19.1 C34.1 C35.1 C36.1 U2.3(REFM) U2.6(AGND) U2.9(AINM) U2.10(AGND) U2.11(NC) U2.12(NC) U2.13(NC) U2.14(NC) U2.15(CH11) U2.16(CH10) U2.19(AGND) U2.20(AGND) U2.30(AGND) U2.35(BDGND) ; port GND
VIN: C2.2 C3.2 C4.2 U2.5(+VA) U2.29(+VA) U2.36(+VBD) ; port VIN
ADCIN0: C1.2 U2.28(CH0)
ADCIN1: C11.2 U2.27(CH1)
ADCIN2: C10.2 U2.26(CH2)
ADCIN3: C13.2 U2.25(CH3)
ADCIN4: C12.2 U2.24(CH4)
ADCIN5: C18.2 U2.23(CH5)
ADCIN6: C14.2 U2.22(CH6)
ADCIN7: C34.2 U2.21(CH7)
ADCIN8: C19.2 U2.18(CH8)
ADCIN9: C35.2 U2.17(CH9)
~{CS}: U2.31(~{CS}) ; port ~{CS}
GPIO0: U2.37(GPIO0)
GPIO1: U2.38(GPIO1)
GPIO2: U2.1(GPIO2)
GPIO3: U2.2(GPIO3)
SCLK: R4.2 ; port SCLK
SDI: U2.33(SDI) ; port SDI
SDO: U2.34(SDO) ; port SDO
VREF+: C36.2 U2.4(REFP) ; port VREF+
NetR4_1: R4.1 U2.32(SCLK)
NetU2_7: U2.7(MXO) U2.8(AINP)

### Channels
ADC1: designators end in .1; ports GND=GND SCLK=SCLK SDI=SDI SDO=SDO VIN=V_ADC VREF+=VREF+ ~{CS}=~{CS}_ADC1
ADC2: designators end in .2; ports GND=GND SCLK=SCLK SDI=SDI SDO=SDO VIN=V_ADC VREF+=VREF+ ~{CS}=~{CS}_ADC2

### Buses and harness runs
bus ADCIN[9..0] = port ADCIN[9..0]
bus GPIO[3..0] = port GPIO[3..0]

### Notes on the sheet
- (near C2) Do not place any vias between a capacitor pin and a device pin
- Place close to power pins
- Place close to input pin
- AGND, BDGND, AINM and REFM must be connected with copper filled ground
- Place directly next to the device

### Library data of the parts
C1 C10-C14 C18 C19 C34 C35 = CS - CAPACITOR: TOLERANCE: 10%; VOLTAGE: 16V; Supplier 1: *; Supplier Part Number 1: *; (FIELD A): *; (FLIED C): *; (FIELD B): *; Manufacturer: *
C2-C4 C36 = CS - CAPACITOR: TOLERANCE: 10%; Supplier 1: *; Supplier Part Number 1: *; (FIELD A): *; (FLIED C): *; (FIELD B): *; Manufacturer: *
R4 = RS - RESISTOR: TOLERANCE: RES TOL; POWER: RES POWER; Supplier Part Number 1: *; Supplier 1: *; (FIELD A): *; (FLIED C): *; (FIELD B): *; Manufacturer: *
U2 = IC - ADS7952-Q1: ADC 12 bits 12 channels MUX SPI

## Sheet Vref.SchDoc
size A4
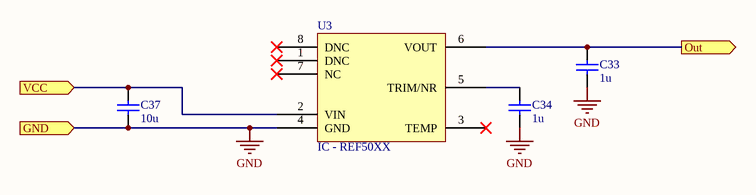
[diagram p7: Vref.SchDoc]

### Parts
C33  value 1u  [CS-0603]  (hidden comment: CS - CAPACITOR)
C34  value 1u  [CS-0603]  (hidden comment: CS - CAPACITOR)
C37  value 10u  [CS-0603]  (hidden comment: CS - CAPACITOR)
U3  IC - REF50XX  [IC-SOIC-8]

### Ports
GND (in), Out (out), VCC (in)

### Nets
GND: C33.1 C34.1 C37.1 U3.4(GND) ; port GND
Prog_VDD: C37.2 U3.2(VIN) ; port VCC
VREF+: C33.2 U3.6(VOUT) ; port Out
NetC34_2: C34.2 U3.5(TRIM/NR)

Not connected (* = marked no-connect by the designer): U3 1(DNC)* 3(TEMP)* 7(NC)* 8(DNC)*

### Library data of the parts
C33 C34 C37 = CS - CAPACITOR: TOLERANCE: 10%; VOLTAGE: 16V; Supplier 1: *; Supplier Part Number 1: *; (FIELD A): *; (FLIED C): *; (FIELD B): *; Manufacturer: *
U3 = IC - REF50XX: VOLTAGE REFERENCE

## Sheet Power_Enable.SchDoc
size A4
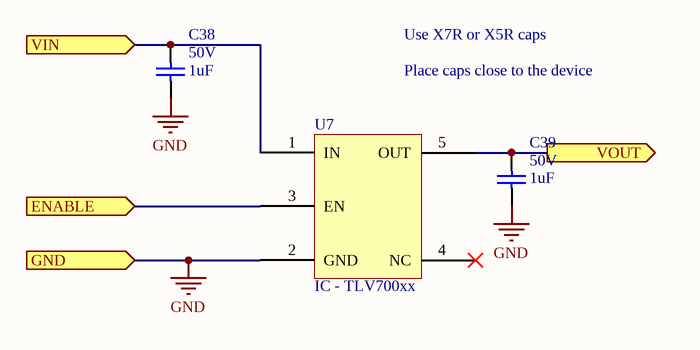
[diagram p8: Power_Enable.SchDoc]

### Parts
C38  value 1uF  VOLTAGE: 50V  [CS-0603]  (hidden comment: CS - CAPACITOR)
C39  value 1uF  VOLTAGE: 50V  [CS-0603]  (hidden comment: CS - CAPACITOR)
U7  IC - TLV700xx  [IC-SOT-23-5]

### Ports
ENABLE (in), GND (in), VIN (in), VOUT (out)

### Nets
GND: C38.1 C39.1 U7.2(GND) ; port GND
Prog_VDD: C38.2 U7.1(IN) ; port VIN
V_ADC: C39.2 U7.5(OUT) ; port VOUT
ADC_EN: U7.3(EN) ; port ENABLE

Not connected (* = marked no-connect by the designer): U7 4(NC)*

### Notes on the sheet
- Use X7R or X5R caps
- Place caps close to the device

### Library data of the parts
C38 C39 = CS - CAPACITOR: TOLERANCE: 10%; Supplier 1: *; Supplier Part Number 1: *; (FIELD A): *; (FLIED C): *; (FIELD B): *; Manufacturer: *
U7 = IC - TLV700xx: LDO

## Sheet PGA.SchDoc
size A4
Used 4 times, as channels U_PGA, U_PGA, U_PGA, U_PGA. Parts and nets are listed once, with the designators drawn on the sheet.
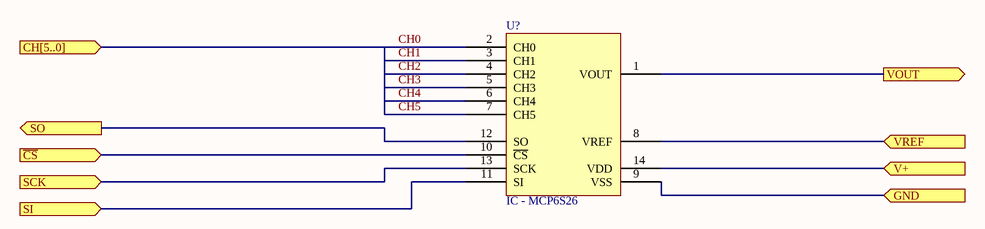
[diagram p9: PGA.SchDoc]

### Parts
U?  IC - MCP6S26  [IC-TSSOP-14]

### Ports
CH[5..0] (in), GND (in), SCK (in), SI (in), SO (out), V+ (in), VOUT (out), VREF (in), ~{CS} (in)

### Nets
~{CS}: U?.10(~{CS}) ; port ~{CS}
CH0: U?.2(CH0)
CH1: U?.3(CH1)
CH2: U?.4(CH2)
CH3: U?.5(CH3)
CH4: U?.6(CH4)
CH5: U?.7(CH5)
GND: U?.9(VSS) ; port GND
SCK: U?.13(SCK) ; port SCK
SI: U?.11(SI) ; port SI
SO: U?.12(SO) ; port SO
V+: U?.14(VDD) ; port V+
VOUT: U?.1(VOUT) ; port VOUT
VREF: U?.8(VREF) ; port VREF

### Channels
U_PGA: designators end in .1; ports GND=NetU?.1_9 SCK=NetU?.1_13 SI=NetU?.1_11 SO=NetU?.1_12 V+=NetU?.1_14 VOUT=NetU?.1_1 VREF=NetU?.1_8 ~{CS}=NetU?.1_10
U_PGA: designators end in .2; ports GND=NetU?.2_9 SCK=NetU?.2_13 SI=NetU?.1_12 SO=NetU?.2_12 V+=NetU?.2_14 VOUT=NetU?.2_1 VREF=NetU?.2_8 ~{CS}=NetU?.2_10
U_PGA: designators end in .3; ports GND=NetU?.3_9 SCK=NetU?.3_13 SI=NetU?.3_11 SO=NetU?.3_12 V+=NetU?.3_14 VOUT=NetU?.3_1 VREF=NetU?.3_8 ~{CS}=NetU?.3_10
U_PGA: designators end in .4; ports GND=NetU?.4_9 SCK=NetU?.4_13 SI=NetU?.3_12 SO=NetU?.4_12 V+=NetU?.4_14 VOUT=NetU?.4_1 VREF=NetU?.4_8 ~{CS}=NetU?.4_10

### Library data of the parts
U? = IC - MCP6S26: Single-Ended, Rail-toRail I/O, Low Gain PGA

## Nets that join several sheets
5V_USB: ControlBoard (J1.1 J2.1), MAT (C30.1.2 C31.1.2 D7.1.K U6.1.12), DBG (C30.2.2 C31.2.2 D7.2.K U6.2.12)
GND: ControlBoard (9 pins), PIC32MX_circuit (14 pins), DC-DC (13 pins), MAT (9 pins), DBG (9 pins), Potentiometer (10 pins), ADC1 (28 pins), ADC2 (28 pins), Vref (C33.1 C34.1 C37.1 U3.4), Power_Enable (C38.1 C39.1 U7.2)
Prog_VDD: ControlBoard (P1.2 TP1.1), PIC32MX_circuit (14 pins), DC-DC (6 pins), MAT (R25.1.2 R26.1.2 R27.1.2 R28.1.2), DBG (R25.2.2 R26.2.2 R27.2.2 R28.2.2), Potentiometer (C28.1 U5.16), Vref (C37.2 U3.2), Power_Enable (C38.2 U7.1)
V_ADC: ADC1 (6 pins), ADC2 (6 pins), Power_Enable (C39.2 U7.5)
Vps: ControlBoard (P11.1), DC-DC (F1.1)
NetU?.1_12: U_PGA (U?.1.12), U_PGA (U?.2.11)
NetU?.3_12: U_PGA (U?.3.12), U_PGA (U?.4.11)
PGEC: ControlBoard (P1.5), PIC32MX_circuit (R13.2)
PGED: ControlBoard (P1.4), PIC32MX_circuit (R14.2)
SCLK: ADC1 (R4.1.2), ADC2 (R4.2.2)
SDI: ADC1 (U2.1.33), ADC2 (U2.2.33)
SDO: ADC1 (U2.1.34), ADC2 (U2.2.34)
U1_RX: PIC32MX_circuit (U4.5), DBG (R25.2.1 U6.2.1)
U1_TX: PIC32MX_circuit (U4.6), DBG (R26.2.1 U6.2.4)
U2_RX: PIC32MX_circuit (U4.8), MAT (R25.1.1 U6.1.1)
U2_TX: PIC32MX_circuit (U4.4), MAT (R26.1.1 U6.1.4)
USB_D+: ControlBoard (J2.3), MAT (R30.1.2)
USB_D+: ControlBoard (J1.3), DBG (R30.2.2)
USB_D-: ControlBoard (J2.2), MAT (R29.1.2)
USB_D-: ControlBoard (J1.2), DBG (R29.2.2)
VPP/~{MCLR}: ControlBoard (P1.1), PIC32MX_circuit (R12.2)
VREF+: ADC1 (C36.1.2 U2.1.4), ADC2 (C36.2.2 U2.2.4), Vref (C33.2 U3.6)